# EAGLE design power (EAGLE 9.6.2)
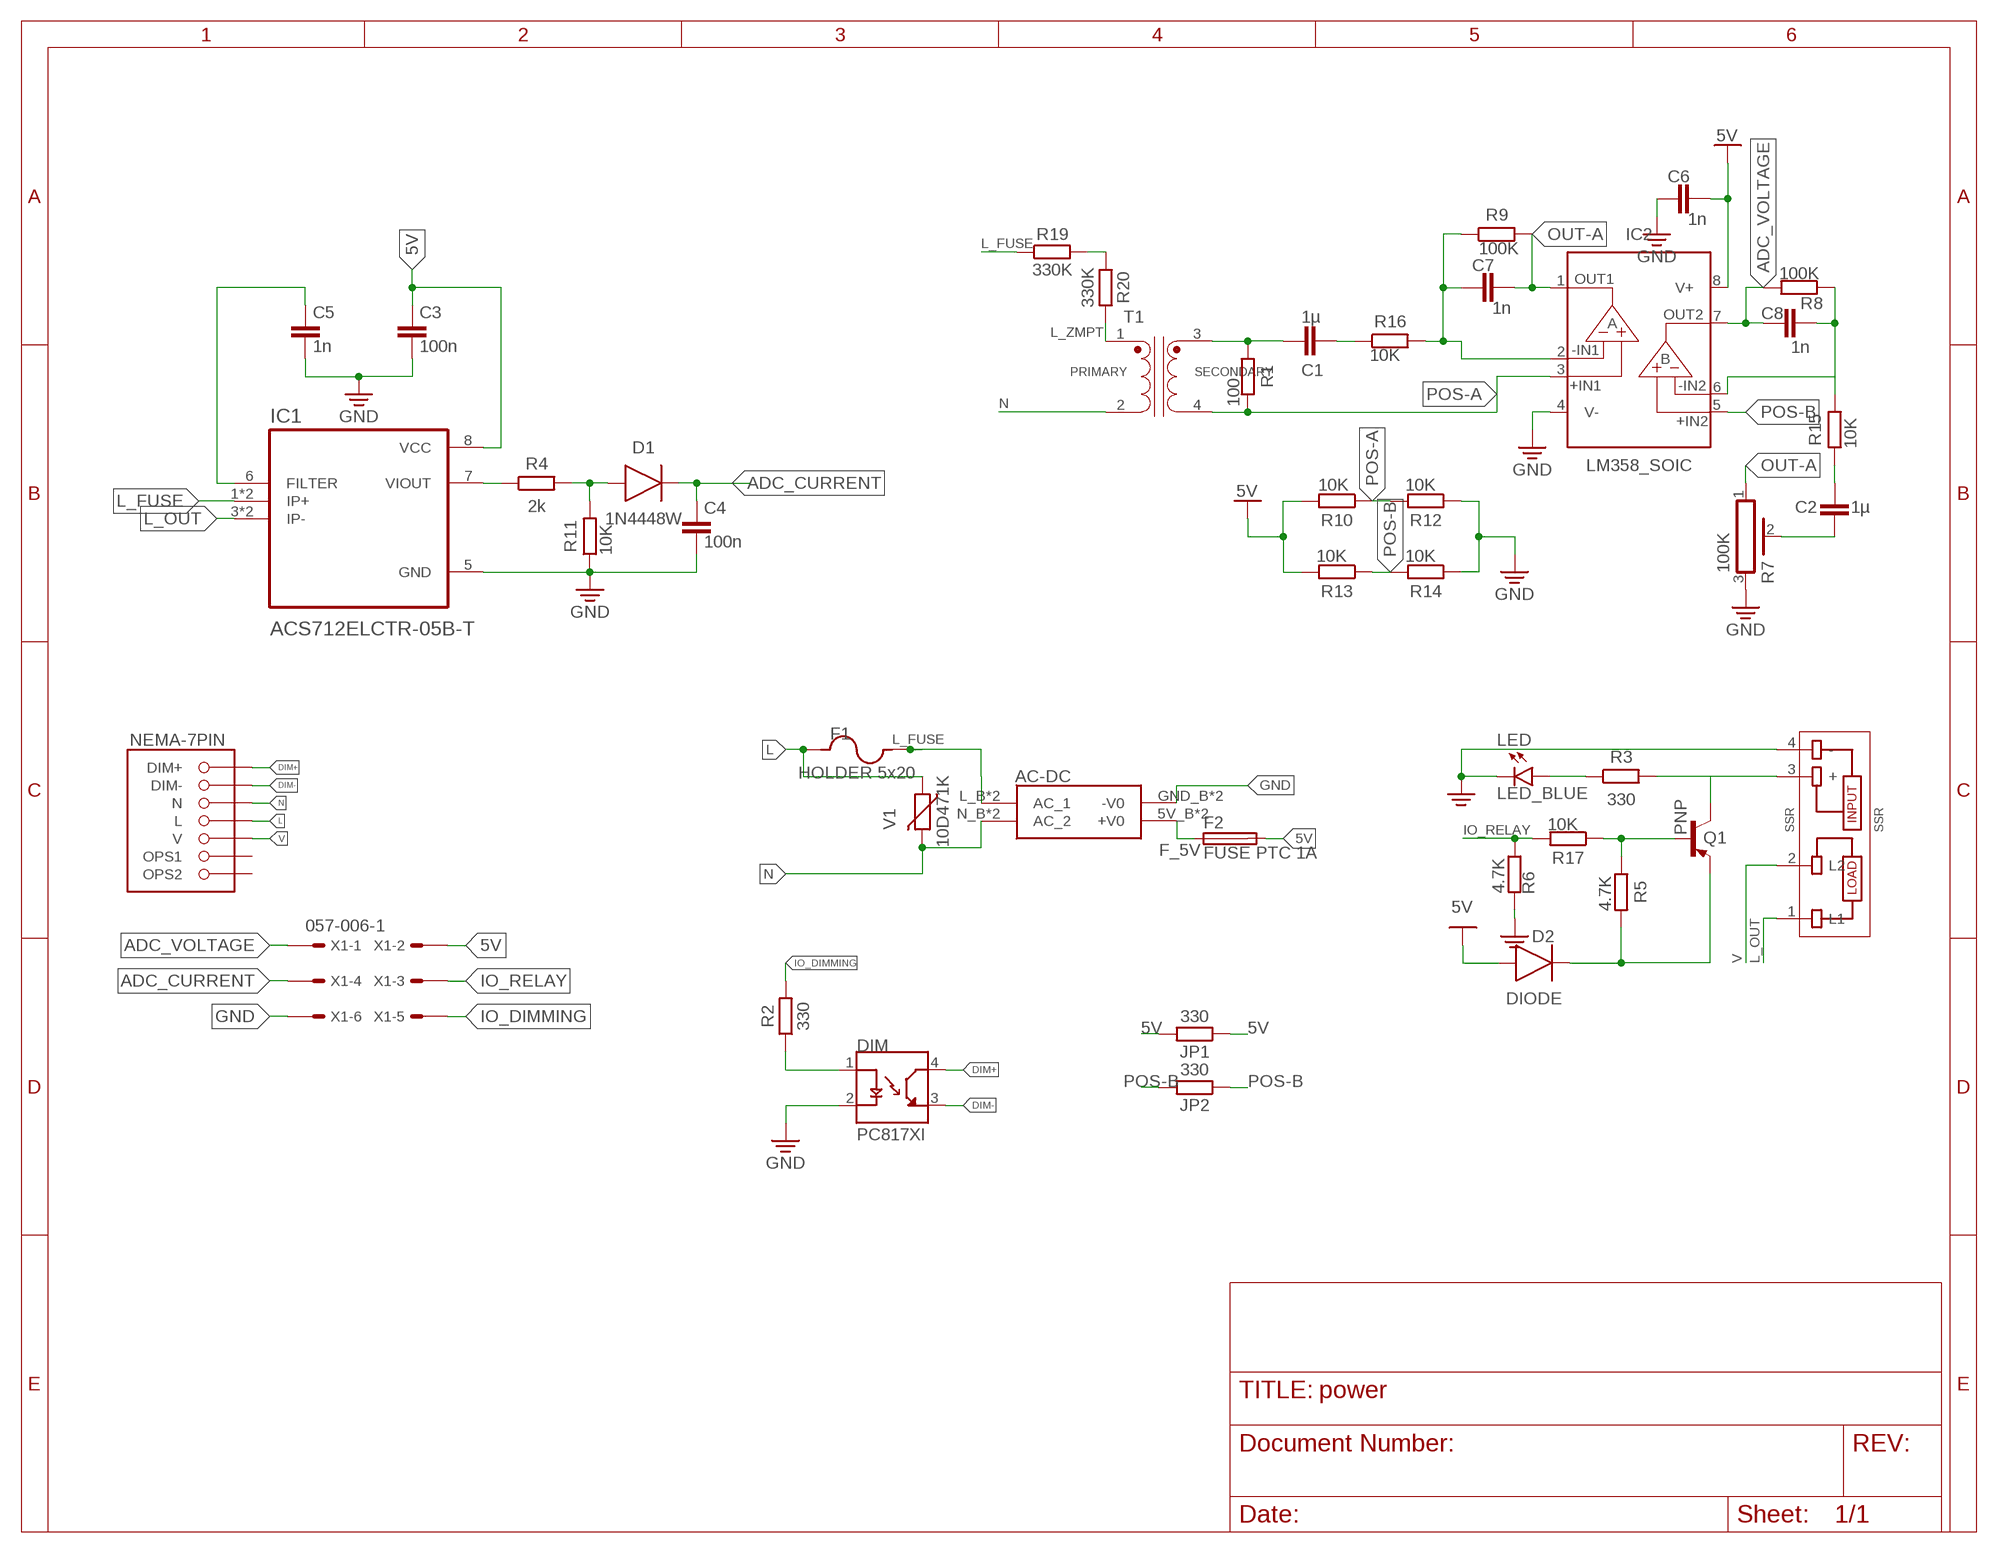
[diagram p0: schematic, sheet 1]

## Parts
AC-DC  HI-LINKVERTICAL  [AC-DC_3.5W(VER)]
C1  1µ  C_CHIP-0805(2012-METRIC)  [CAPC2012X110]
C2  1µ  C_CHIP-0805(2012-METRIC)  [CAPC2012X110]
C3  100n  C_CHIP-0805(2012-METRIC)  [CAPC2012X110]
C4  100n  C_CHIP-0805(2012-METRIC)  [CAPC2012X110]
C5  1n  C_CHIP-0805(2012-METRIC)  [CAPC2012X110]
C6  1n  C_CHIP-0805(2012-METRIC)  [CAPC2012X110]
C7  1n  C_CHIP-0805(2012-METRIC)  [CAPC2012X110]
C8  1n  C_CHIP-0805(2012-METRIC)  [CAPC2012X110]
D1  1N4448W  DIODE_1N4148W-7-F_SOD123G  [SOD3715X135]
D2  DIODE  DIODEDO-214AC(SMA)  [DIOM5226X290N]
DIM  PC817XI  [SOIC254P975X460-4N]
F1  HOLDER 5x20  4527  [4527]
F2  FUSE PTC 1A  FUSE_CHIP-1206(3216-METRIC)  [FUSC3215X82N]
IC1  ACS712ELCTR-05B-T  [SOIC127P600X175-8N@1]
IC2  LM358_SOIC  [SOIC127P600X175-8N]
JP1  330  R_CHIP-0805(2012-METRIC)  [RESC2012X65]
JP2  330  R_CHIP-0805(2012-METRIC)  [RESC2012X65]
LED  LED_BLUE  CHIP-FLAT-B_0805  [LEDC2012X110N_FLAT-B]
NEMA-7PIN  NEMA-7P  [NEMA-7P]
Q1  PNP  PNP_SOT23-BEC  [SOT95P237X112-3N]
R1  100  R_CHIP-0805(2012-METRIC)  [RESC2012X65]
R2  330  R_CHIP-0805(2012-METRIC)  [RESC2012X65]
R3  330  R_CHIP-0805(2012-METRIC)  [RESC2012X65]
R4  2k  R_CHIP-0805(2012-METRIC)  [RESC2012X65]
R5  4.7K  R_CHIP-0805(2012-METRIC)  [RESC2012X65]
R6  4.7K  R_CHIP-0805(2012-METRIC)  [RESC2012X65]
R7  100K  PV36W  [PV36W]
R8  100K  R_CHIP-0805(2012-METRIC)  [RESC2012X65]
R9  100K  R_CHIP-0805(2012-METRIC)  [RESC2012X65]
R10  10K  R_CHIP-0805(2012-METRIC)  [RESC2012X65]
R11  10K  R_CHIP-0805(2012-METRIC)  [RESC2012X65]
R12  10K  R_CHIP-0805(2012-METRIC)  [RESC2012X65]
R13  10K  R_CHIP-0805(2012-METRIC)  [RESC2012X65]
R14  10K  R_CHIP-0805(2012-METRIC)  [RESC2012X65]
R15  10K  R_CHIP-0805(2012-METRIC)  [RESC2012X65]
R16  10K  R_CHIP-0805(2012-METRIC)  [RESC2012X65]
R17  10K  R_CHIP-0805(2012-METRIC)  [RESC2012X65]
R19  330K  R_AXIAL-7.2MM-PITCH  [RESAD724W46L381D178B]
R20  330K  R_AXIAL-7.2MM-PITCH  [RESAD724W46L381D178B]
SSR  SSR  [SSR_G3MB-202P]
T1  ZMPT101B  [ZMPT101B]
V1  10D471K  VARISTOR  [MOV-10D561]
X1  057-006-1  [057-006-1]

## Nets
5V: C3.1 C6.2 D2.2(A) F2.2 IC1.8(VCC) IC2.8(V+) JP1.1 JP1.2 R10.2 R13.2 X1.2
ADC_CURRENT: C4.1 D1.1(C) X1.4
ADC_VOLTAGE: C8.1 IC2.7(OUT2) R8.2 X1.1
DIM+: DIM.4(CT) NEMA-7PIN.DIM+
DIM-: DIM.3(ET) NEMA-7PIN.DIM-
F_5V: AC-DC.5V_B(+V0) AC-DC.5V_T(+V0) F2.1
GND: AC-DC.GND_B(-V0) AC-DC.GND_T(-V0) C3.2 C4.2 C5.2 C6.1 DIM.2(C) IC1.5(GND) IC2.4(V-) LED.C R6.2 R7.3 R11.1 R12.1 R14.1 SSR.4(-) X1.6
IO_DIMMING: R2.2 X1.5
IO_RELAY: R6.1 R17.2 X1.3
L: F1.1 NEMA-7PIN.L V1.1
L_FUSE: AC-DC.L_B(AC_1) AC-DC.L_T(AC_1) F1.2 IC1.1(IP+) IC1.2(IP+) R19.1
L_OUT: IC1.3(IP-) IC1.4(IP-) SSR.1(L1)
L_ZMPT: R20.2 T1.1
N: AC-DC.N_B(AC_2) AC-DC.N_T(AC_2) NEMA-7PIN.N T1.2 V1.2
N$1: C1.1 R1.1 T1.3
N$3: C1.2 R16.1
N$4: IC1.7(VIOUT) R4.1
N$5: R19.2 R20.1
N$6: C7.1 IC2.2(-IN1) R9.1 R16.2
N$9: D1.2(A) R4.2 R11.2
N$11: C5.1 IC1.6(FILTER)
N$12: D2.1(C) Q1.2(E) R5.2
N$13: Q1.1(B) R5.1 R17.1
N$15: Q1.3(C) R3.2 SSR.3(+)
N$16: C8.2 IC2.6(-IN2) R8.1 R15.2
N$17: C2.2 R15.1
N$18: C2.1 R7.2
N$24: LED.A R3.1
N$27: DIM.1(A) R2.1
OUT-A: C7.2 IC2.1(OUT1) R7.1 R9.2
POS-A: IC2.3(+IN1) R1.2 R10.1 R12.2 T1.4
POS-B: IC2.5(+IN2) JP2.1 JP2.2 R13.1 R14.2
V: NEMA-7PIN.V SSR.2(L2)
Unconnected: NEMA-7PIN.OPS1 NEMA-7PIN.OPS2

## Library data of the parts
AC-DC = XLKM#4:HI-LINK: HI-LINK HLK-10M05 Manufacturer : HI-LINK <https://lcsc.com//brand-detail/11515.html> Mfr.Part # HLK-10M05 LCSC Part # C403745 <https://lcsc.com/product-detail/show_C403745.html> Package : Through Hole Datasheet :  EasyEDA Model <javascript:void(0);> Power Module AC-DC Through Hole RoHS Source: Datasheet <https://datasheet.lcsc.com/szlcsc/1909111105_HI-LINK-HLK-10M05_C403745.pdf>
C1-C8 = Capacitor:C: Capacitor - Generic; CATEGORY: Capacitor
D1 = Diode:DIODE_: Diode Rectifier - Popular parts; CATEGORY: Diode; DESCRIPTION: DIODE GEN PURP 100V 300MA SOD123; MANUFACTURER: Diodes Incorporated; SUB-CATEGORY: Rectifier; VALUE: 1N4148W
D2 = Diode:DIODE: Diode Rectifier - Generic; CATEGORY: Diode; SUB-CATEGORY: Rectifier
DIM = SnapEDA Library:PC817XI: Semiconductors and Actives, Optocouplers/Optoisolators, trans, Optoelectronics, smd; MF: Sharp; STANDARD: IPC-7351B
F1 = Fuse Holder:4527: FUSE HLDR CARTRIDGE 250V 5A PCB Manufacturer's datasheet <https://www.keyelco.com/userAssets/file/M65p44.pdf>; CREATED_BY: PCBLayout.com; DIGIKEY_PN: 36-4527-ND; MANUFACTURER: Keystone Electronics; MPN: 4527
F2 = Circuit-Protection:FUSE: Fuse - Generic; CATEGORY: Circuit-Protection; SUB-CATEGORY: Fuse
IC1 = XLKM#4:ACS712ELCTR-05B-T
IC2 = IC_Linear:LM358: Dual Operational Amplifier Reference Datasheet <https://www.ti.com/lit/ds/symlink/lm158-n.pdf>; CATEGORY: Amplifier; DESCRIPTION: Dual Operational Amplifier; MANUFACTURER: Generic; MPN: Generic; SERIES: LM358; SUB-CATEGORY: OpAmp; TYPE: Dual
JP1 JP2 R1-R6 R8-R17 R19 R20 = Resistor:R: Resistor Fixed - Generic; CATEGORY: Resistor; SUB-CATEGORY: Fixed
LED = LED:CHIP-FLAT-B; CATEGORY: LED; COLOR: BLUE; DESCRIPTION: CHIP LED FLAT; SUB-CATEGORY: CHIP; TYPE: FLAT_TOP
NEMA-7PIN = XLKM#4:NEMA-7P
Q1 = Transistor:PNP: PNP - Generic; CATEGORY: Transistor; SUB-CATEGORY: BJT; TYPE: PNP
R7 = Resistor:PV36: Rectangular Trimmer Potentiometers - PV36 Series Datasheet <https://www.bourns.com/docs/Product-Datasheets/pv36.pdf>; CATEGORY: Resistor; DESCRIPTION: Lead Sealed Type Multiturn PV36 Series; MANUFACTURER: BOURNS; MPN: PV36W; OPERATING_TEMPERATURE: -55 to +125 °C; PART_STATUS: Active; ROHS_COMPLIANCE: RoHS Compliant; SERIES: PV36; SUB-CATEGORY: Trimpot; TYPE: Lead Sealed
SSR = XLKM#4:SSR: Relay 12vdc Isolation Photot; MANUFACTURER: Omron; PARTREV: N/A; STANDARD: Manufacturer Recommendation
T1 = XLKM#4:ZMPT101B: Current-type Voltage Transformer; MANUFACTURER: Qingxian Zeming Langxi Electronic; MAXIMUM_PACKAGE_HEIGHT: 18.8mm; PARTREV: NA; STANDARD: Manufacturer Recommendations
V1 = XLKM#4:VARISTOR
X1 = con-panduit:057-006-: CONNECTOR 6-pin series 057 contact pc board low profile headers; OC_FARNELL: unknown; OC_NEWARK: unknown

## Board
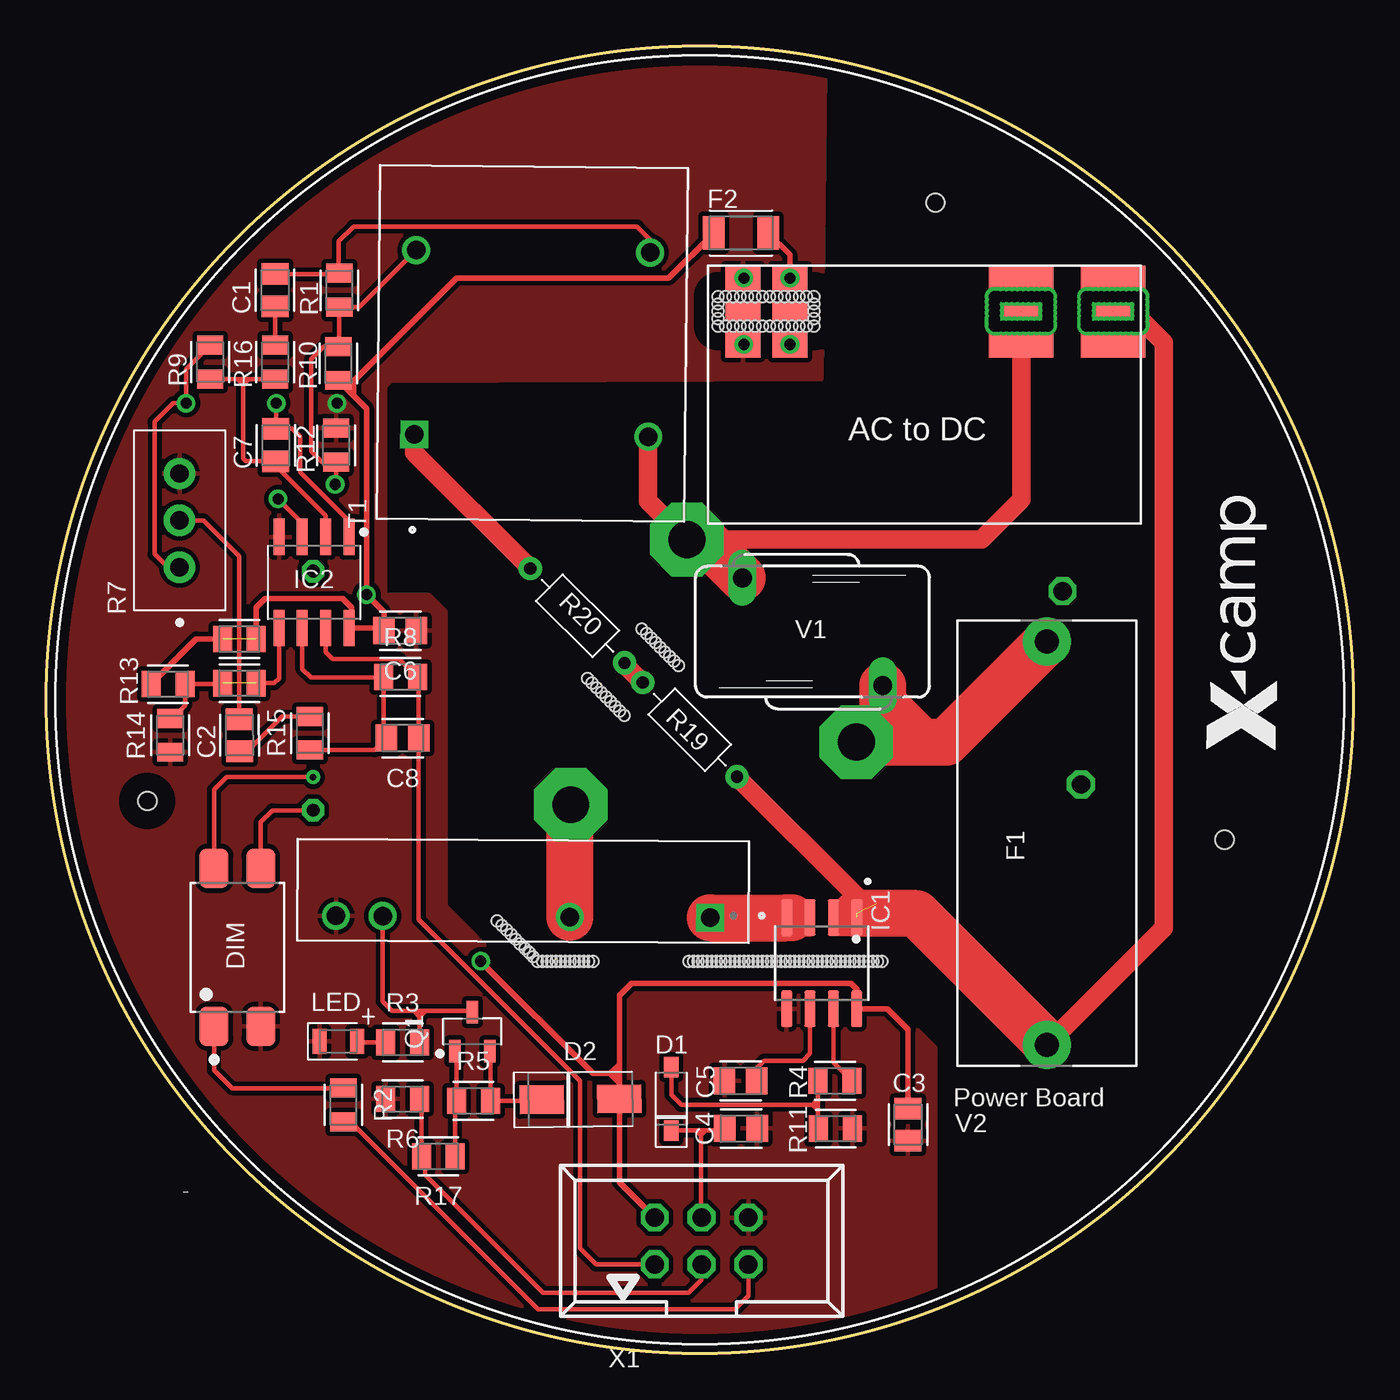
[diagram p1: board, top side]
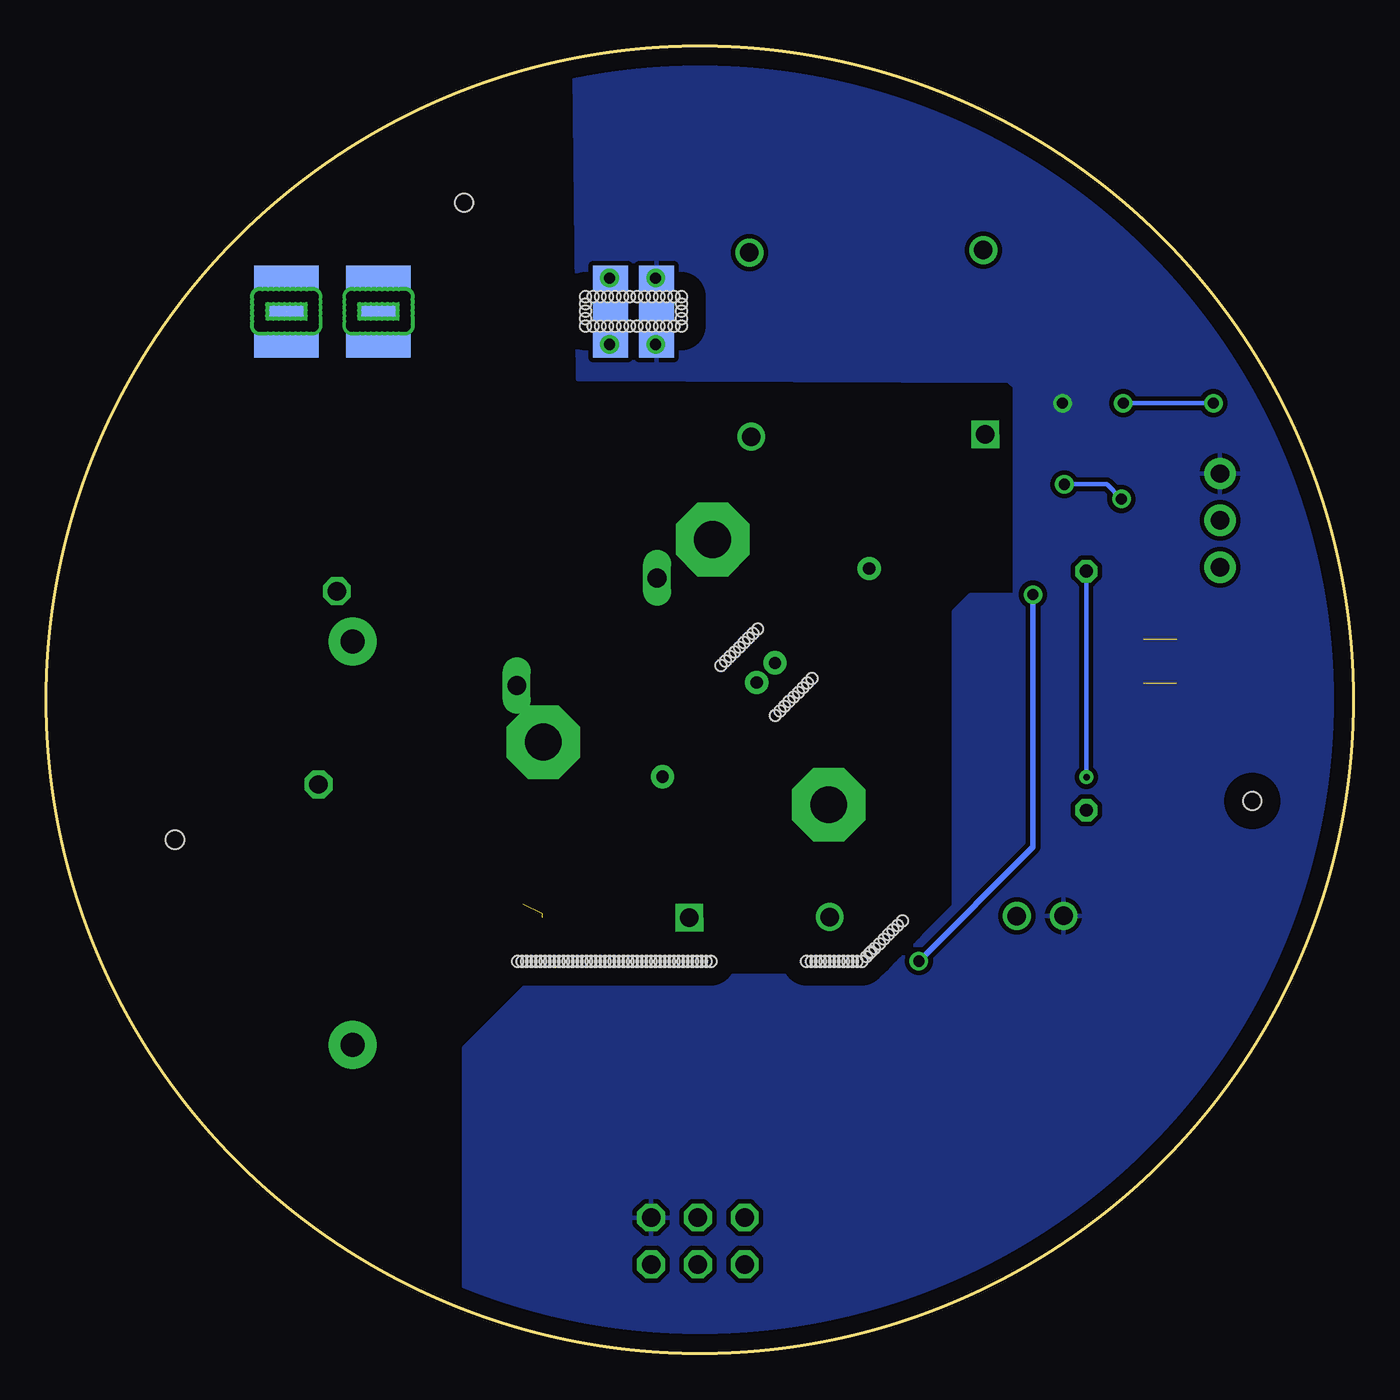
[diagram p2: board, bottom side, seen from below]

Size 71 x 71 mm. Coordinates in mm from the lower left corner, seen from the top.
Outline: circle at 35.5,35.5 radius 35.5
Copper layers (1*16): Top 0.035mm / dielectric 1.5mm / Bottom 0.035mm
Design rules "default": minimum track width 6mil, minimum drill 0.35mm, track to track 6mil, track to pad 6mil, pad to pad 6mil, via to via 6mil, smd to smd 6mil, copper to edge 40mil, drill to drill 6mil, minimum pad ring 10mil, minimum via ring 8mil, stop-mask expansion 4mil, vias tented up to drill 0mil, thermal gap 10mil
Holes 0.6 mm at 37.4,21.3 36.9,21.3 37.9,21.3 38.4,21.3 38.9,21.3 39.4,21.3 39.9,21.3 40.4,21.3 40.9,21.3 41.4,21.3 41.9,21.3 42.4,21.3 42.9,21.3 43.4,21.3 43.9,21.3 44.4,21.3 44.9,21.3 45.4,21.3 36.4,21.3 35.9,21.3 35.4,21.3 34.9,21.3 29.7,21.3 29.2,21.3 28.7,21.3 28.2,21.3 27.7,21.3 27.2,21.3 26.7,21.3 26.2,21.8 26,22 25.5,22.5 25,23 24.5,23.5 24.75,23.25 25.25,22.75 25.75,22.25 26.25,21.75 26.45,21.55 26.95,21.3 27.45,21.3 27.95,21.3 28.45,21.3 28.95,21.3 29.45,21.3 35.15,21.3 35.65,21.3 36.15,21.3 36.65,21.3 37.15,21.3 37.65,21.3 38.15,21.3 38.65,21.3 39.15,21.3 39.65,21.3 40.15,21.3 40.65,21.3 41.15,21.3 41.65,21.3 42.15,21.3 42.65,21.3 43.15,21.3 43.65,21.3 44.15,21.3 44.65,21.3 45.15,21.3 29.4,36.65 29.65,36.4 29.9,36.15 30.15,35.9 30.4,35.65 30.65,35.4 30.9,35.15 31.15,34.9 31.4,34.65 32.35,39.35 32.6,39.1 32.85,38.85 33.1,38.6 33.35,38.35 33.6,38.1 33.85,37.85 34.1,37.6 34.35,37.35 36.5,57.4 36.5,56.6 36.5,55.8 37.3,55.8 38.1,55.8 38.9,55.8 41.3,55.8 41.7,55.8 39.3,55.8 38.5,55.8 37.7,55.8 36.9,55.8 36.5,56.2 36.5,57 36.9,57.4 37.3,57.4 37.7,57.4 41.7,56.2 41.7,56.6 41.7,57 41.7,57.4 41.3,57.4 39.3,57.4 38.9,57.4 38.5,57.4 38.1,57.4 39.7,57.4 40.1,57.4 40.5,57.4 40.9,57.4 39.7,55.8 40.1,55.8 40.5,55.8 40.9,55.8
Holes 1 mm at 5.5,30 48.3,62.5 64,27.9

### Footprints (pad centres in the part's own frame; a part is rotated, then mirrored left to right if it is on the bottom)
AC-DC_3.5W(VER) = smd 1.9 x 5 bottom: 5V_B -7.2,3.8; GND_B -9.7,3.8 | smd 1.9 x 5: 5V_T -7.16,3.8; GND_T -9.7,3.8 | smd 3.5 x 5 bottom: L_B 10.4,3.8; N_B 5.4,3.8 | smd 3.5 x 5: L_T 10.4,3.8; N_T 5.4,3.8
CAPC2012X110 = smd 1.165 x 1.465: 1 -0.875,0; 2 0.875,0
SOD3715X135 = smd 1.127 x 0.784: 1 -1.722,0; 2 1.722,0
DIOM5226X290N = smd 2.392 x 1.565: 1 -2.108,0; 2 2.108,0
SOIC254P975X460-4N = smd 2.13 x 1.57: 1 -4.29,1.27; 2 -4.29,-1.27; 3 4.29,-1.27; 4 4.29,1.27
4527 = drill 1.3 pad 2.6: 1 -10.95,0; 2 10.95,0
FUSC3215X82N = smd 1.165 x 1.814: 1 -1.475,0; 2 1.475,0
SOIC127P600X175-8N@1 = smd 1.97 x 0.6: 1 -2.475,1.905; 2 -2.475,0.635; 3 -2.475,-0.635; 4 -2.475,-1.905; 5 2.475,-1.905; 6 2.475,-0.635; 7 2.475,0.635; 8 2.475,1.905
SOIC127P600X175-8N = smd 1.969 x 0.592: 1 -2.474,1.905; 2 -2.474,0.635; 3 -2.474,-0.635; 4 -2.474,-1.905; 5 2.474,-1.905; 6 2.474,-0.635; 7 2.474,0.635; 8 2.474,1.905
RESC2012X65 = smd 1.031 x 1.42: 1 -0.919,0; 2 0.919,0
LEDC2012X110N_FLAT-B = smd 0.762 x 1.362: A 1.025,0; C -1.025,0
NEMA-7P = drill 0.7 octagon: DIM+ -21,6.98; DIM- -21,-6 | drill 2 pad 4 octagon: L 8.5,-2.3; N -0.7,8.7; V -7,-5.7 | drill 1 octagon: OPS1 19.7,5.9; OPS2 20.7,-4.6
SOT95P237X112-3N = smd 1.224 x 0.625: 1 -1.064,0.95; 2 -1.064,-0.95; 3 1.064,0
PV36W = drill 1 pad 1.7: 1 0,0; 2 2.54,0; 3 5.08,0
RESAD724W46L381D178B = drill 0.66 pad 1.26: 1 -3.62,0; 2 3.62,0
SSR_G3MB-202P = drill 1 square: 1 -10.16,1.4 | drill 1: 2 -2.54,1.4; 3 7.62,1.4; 4 10.16,1.4
ZMPT101B = drill 1 square: 1 -5,6.35 | drill 1: 2 -5,-6.35; 3 5,-6.35; 4 5,6.35
MOV-10D561 = drill 1.016 long: 1 -2.921,-3.81; 2 2.921,3.81
057-006-1 = drill 1 octagon: 1 -2.54,-1.27; 2 -2.54,1.27; 3 0,-1.27; 4 0,1.27; 5 2.54,-1.27; 6 2.54,1.27

### Placement (x,y rotation side)
AC-DC  47.55,52.78 0 top
C1  12.44,57.74 270 top
C2  10.51,33.57 270.4 top
C3  46.81,12.43 270 top
C4  37.74,12.21 0 top
C5  37.72,14.8 180 top
C6  19.23,39.25 180 top
C7  12.48,49.33 90 top
C8  19.36,33.42 180 top
D1  33.95,13.83 90 top
D2  29.03,13.8 0.6 top
DIM  10.39,22.06 90 top
F1  54.35,27.71 270 top
F2  37.74,60.85 180 top
IC1  42.12,21.19 270 top
IC2  14.55,41.87 270 top
JP1  10.5,38.8 0 top
JP2  10.5,36.4 0 top
LED  15.87,16.95 0 top
NEMA-7PIN  35.5,35.5 0 top
Q1  23.15,17.48 90 top
R1  15.93,57.74 270 top
R2  16.15,13.5 270 top
R3  19.37,16.89 0 top
R4  42.84,14.8 180 top
R5  23.21,13.72 0 top
R6  19.36,13.82 180 top
R7  7.25,42.7 90 top
R8  19.25,36.74 0 top
R9  8.91,53.83 90 top
R10  15.88,53.76 270 top
R11  42.88,12.21 180 top
R12  15.75,49.32 270 top
R13  6.63,36.35 180 top
R14  6.74,33.57 90 top
R15  14.33,33.68 270 top
R16  12.45,53.83 270 top
R17  21.3,10.71 180 top
R19  34.96,33.88 135 top
R20  28.86,40.06 135 top
SSR  25.91,25.11 179.7 top
T1  26.4,54.85 89.4 top
V1  41.63,39.19 90 top
X1  35.6,6.11 0 top

### Tracks (layer width: path | path; a pad name or v marks a point on that pad's centre or on a via)
5V  (via drill 0.6 pad 1)  (1 unrouted)
  Top 0.305: C3.1 46.81,17.59 45.68,18.72 IC1.8 44.03,19.77 43.7,20.1 31.8,20.1 31.14,19.44 31.14,15.7 | F2.2 33.82,58.4 22.3,58.4 16.74,52.84 16.7,52.84 | 16.7,52.84 R10.2 16.66,52.06 | 16.66,52.06 17.4,51.32 v17.4,41.21 18.36,40.25 | 16.7,52.84 16.7,52.1 16.66,52.06 | 18.36,40.25 18.15,40.45 | 18.36,40.25 C6.2 18.21,39.4 IC2.8 16.61,39.25 16.61,40.49 16.1,41 11.9,41 11.42,40.52 JP1.2 | X1.2 31.14,9.3 D2.2 31.14,14.7 | 31.14,14.7 31.14,15.2 | 31.14,15.2 31.14,15.7 | v23.6,21.3 29.71,15.2 30.64,15.2 | 31.14,15.7 30.72,15.28 | 30.72,15.28 30.64,15.2 | 30.64,15.2 30.72,15.12 | 30.72,15.12 31.14,14.7 | 30.72,15.12 30.72,15.28 | 31.14,15.2 30.8,15.2 30.72,15.12 | JP1.1 8.16,38.8 R13.2
  Bottom 0.305: v17.4,41.21 17.4,27.51 v23.6,21.3
ADC_CURRENT
  Top 0.254: D1.1 35.3,12.11 | 35.3,12.11 35.8,12.11 | 35.8,12.11 36.76,12.11 C4.1 | X1.4 35.57,7.41 35.57,11.7 35.57,11.84 | 35.57,11.84 35.3,12.11 | 35.57,11.84 35.57,11.88 35.8,12.11
ADC_VOLTAGE
  Top 0.254: 20.27,33.45 C8.1 | 15.19,39.5 IC2.7 15.19,38.1 15.56,37.73 19.18,37.73 R8.2 20.24,36.66 C8.1 | C8.1 20.24,23.56 29,14.8 29,5.7 29.86,4.84 X1.1
DIM+  (via drill 0.35)
  Top 0.254: DIM.4 9.12,30.62 9.8,31.3 v14.5,31.3
  Bottom 0.254: v14.5,31.3 NEMA-7PIN.DIM+
DIM-
  Top 0.254: DIM.3 11.66,28.86 12.3,29.5 NEMA-7PIN.DIM-
F_5V  (via drill 0.6 pad 1)
  Top 0.305: F2.1 40.39,59.68 AC-DC.5V_T | v40.4,58.4 40.4,56.59 AC-DC.5V_T | AC-DC.5V_T 40.4,56.56 v40.4,54.8
  Bottom 0.305: AC-DC.5V_B 40.4,56.52 v40.4,54.8
GND  (via drill 0.6 pad 1)
  other vias: 37.9,54.8 37.9,58.4 15.8,51.6
  pour Bottom (isolate 0.254): 18.7,52.8 18.4,52.5 18.4,41.2 20.8,41.2 21.7,40.3 21.7,24.3 25.5,20.5 44.4,20.5 48.3,16.6 48.3,0.1 48.1,-0.1 20.2,-0.1 -0.1,20.2 -0.1,50.9 20.6,71.6 40.3,71.6 42.31,69.59 42.1,52.9
  pour Top (isolate 0.254): 18.7,52.8 18.4,52.5 18.4,41.2 20.8,41.2 21.7,40.3 21.7,24.3 25.5,20.5 44.4,20.5 48.3,16.6 48.3,0.1 48.1,-0.1 20.2,-0.1 -0.1,20.2 -0.1,50.9 20.6,71.6 40.3,71.6 42.31,69.59 42.1,52.9
IO_DIMMING
  Top 0.254: R2.2 16.55,12.58 26.73,2.4 37.4,2.4 38.14,3.14 X1.5
IO_RELAY
  Top 0.254: R6.1 20.38,13.72 R17.2 20.58,10.51 20.58,9.71 26.99,3.3 34.9,3.3 35.6,4 X1.3
L
  Top 1.016: NEMA-7PIN.L 45.44,34.64 V1.1
  Top 2.54: NEMA-7PIN.L 47.53,33.2 45.44,35.29 V1.1 | NEMA-7PIN.L 44,33.31 | NEMA-7PIN.L 48.89,33.2 F1.1
L_FUSE  (3 unrouted)
  Top 0.508: 45.1,24.4 42.9,24.4 42.76,24.26 IC1.2 42.76,22.94 42.77,22.93 45.15,22.93
  Top 1.016: AC-DC.L_T 59.02,56.58 60.7,54.9 60.7,23.11 F1.2 | R19.1 44.03,24.81 IC1.1
  Top 2.54: 44.03,23.89 47.27,23.89 54.35,16.81 F1.2
L_OUT
  Top 0.508: IC1.3 41.49,24.31 41.4,24.4 40.3,24.4 | IC1.3 41.49,22.9 40.1,22.9 | 40.5,23.67 IC1.3
  Top 2.54: SSR.1 IC1.4 40.5,23.67
L_ZMPT
  Top 1.016: R20.2 20,48.93 T1.1
N  (1 unrouted)
  Top 1.016: T1.2 32.7,46.3 NEMA-7PIN.N 50.8,44.2 52.97,46.37 52.97,56.55 AC-DC.N_T
  Top 2.54: 34.62,44.02 NEMA-7PIN.N 35.73,44.2 V1.2
N1
  Top 1.016: 57.97,56.55 57.95,56.58
N$1
  Top 0.254: T1.3 32.8,60.5 32.1,61.2 16.7,61.2 15.9,60.4 15.9,58.68 R1.1 15.89,58.62 C1.1
N$2  (via drill 0.6 pad 1)
  other vias: 51.7,55.8
N$3
  Top 0.254: C1.2 12.44,54.77 R16.1
N$4
  Top 0.254: IC1.7 42.76,15.81 R4.1
N$5
  Top 1.016: R19.2 31.42,37.42 R20.1
N$6
  Top 0.254: R9.1 10.4,52.91 | 10.4,52.91 11,52.91 | 11,52.91 R16.2 | 11,52.91 10.7,52.61 | 10.7,52.61 10.7,48.6 10.85,48.45 C7.1 12.48,48.22 15.19,45.51 IC2.2 | 10.7,52.61 10.4,52.91
N$7  (via drill 0.6 pad 1)
  other vias: 52,55.8
N$8  (via drill 0.6 pad 1)
  other vias: 52.3,55.8
N$9
  Top 0.254: R4.2 41.92,13.8 | 41.92,13.8 41.92,13.3 | 41.92,13.3 41.92,12.25 R11.2 | 41.92,13.8 41.62,13.5 | 41.62,13.5 41.83,13.3 41.92,13.3 | D1.2 33.95,14.05 34.5,13.5 41.62,13.5
N$10  (via drill 0.6 pad 1)
  other vias: 52.6,55.8
N$11
  Top 0.254: IC1.6 41.49,16.29 41.1,15.9 39,15.9 38.59,15.49 C5.1
N$12
  Top 0.254: Q1.2 24.13,16.39 R5.2 26.86,13.72 D2.1
N$13
  Top 0.254: R5.1 22.29,14 | 22.29,14 22.29,16.33 Q1.1 | R17.1 22.22,13.93 22.29,14
N$14  (via drill 0.6 pad 1)
  other vias: 52.9,55.8
N$15
  Top 0.254: R3.2 20.29,18.29 | 20.29,18.29 20.6,18.6 | 20.6,18.6 23.1,18.6 Q1.3 | SSR.3 18.28,19.12 18.8,18.6 19.9,18.6 19.98,18.6 | 19.98,18.6 20.6,18.6 | 20.29,18.29 19.98,18.6
N$16
  Top 0.254: C8.2 17.83,32.76 R15.2 | 18.43,33.48 C8.2 | C8.2 18.33,33.58 R8.1 18.29,36.7 14.4,36.7 13.92,37.18 IC2.6
N$17
  Top 0.254: C2.2 10.91,32.7 12.82,34.6 R15.1
N$18
  Top 0.254: R7.2 8.55,45.24 10.5,43.29 C2.1
N$19  (via drill 0.6 pad 1)
  other vias: 53.2,55.8
N$20  (via drill 0.6 pad 1)
  other vias: 53.5,55.8
N$21  (via drill 0.6 pad 1)
  other vias: 53.8,55.8
N$22  (via drill 0.6 pad 1)
  other vias: 54.1,55.8
N$23  (via drill 0.6 pad 1)
  other vias: 54.2,55.8
N$24
  Top 0.254: LED.A 16.96,16.89 R3.1
N$25  (via drill 0.6 pad 1)
  other vias: 51.7,57.4
N$26  (via drill 0.6 pad 1)
  other vias: 52,57.4
N$27
  Top 0.254: R2.1 16.13,14.4 10.1,14.4 9.12,15.38 DIM.1
N$28  (via drill 0.6 pad 1)
  other vias: 52.3,57.4
N$29  (via drill 0.6 pad 1)
  other vias: 52.6,57.4
N$30  (via drill 0.6 pad 1)
  other vias: 52.9,57.4
N$31  (via drill 0.6 pad 1)
  other vias: 53.2,57.4
N$32  (via drill 0.6 pad 1)
  other vias: 53.5,57.4
N$33  (via drill 0.6 pad 1)
  other vias: 53.8,57.4
N$34  (via drill 0.6 pad 1)
  other vias: 54.1,57.4
N$35  (via drill 0.6 pad 1)
  other vias: 54.4,57.4
N$36  (via drill 0.6 pad 1)
  other vias: 54.4,57.1
N$37  (via drill 0.6 pad 1)
  other vias: 54.4,56.8
N$38  (via drill 0.6 pad 1)
  other vias: 54.4,56.5
N$39  (via drill 0.6 pad 1)
  other vias: 54.4,56.2
N$40  (via drill 0.6 pad 1)
  other vias: 54.4,55.9
N$41  (via drill 0.6 pad 1)
  other vias: 54.4,55.8
N$42  (via drill 0.6 pad 1)
  other vias: 51.5,57.4
N$43  (via drill 0.6 pad 1)
  other vias: 51.5,57.1
N$44  (via drill 0.6 pad 1)
  other vias: 51.5,56.8
N$45  (via drill 0.6 pad 1)
  other vias: 51.5,56.5
N$46  (via drill 0.6 pad 1)
  other vias: 51.5,56.2
N$47  (via drill 0.6 pad 1)
  other vias: 51.5,56
N$48  (via drill 0.6 pad 1)
  other vias: 51.5,55.8
N$49  (via drill 0.6 pad 1)
  other vias: 56.7,55.8
N$50  (via drill 0.6 pad 1)
  other vias: 57,55.8
N$51  (via drill 0.6 pad 1)
  other vias: 57.3,55.8
N$52  (via drill 0.6 pad 1)
  other vias: 57.6,55.8
N$53  (via drill 0.6 pad 1)
  other vias: 57.9,55.8
N$54  (via drill 0.6 pad 1)
  other vias: 58.2,55.8
N$55  (via drill 0.6 pad 1)
  other vias: 58.5,55.8
N$56  (via drill 0.6 pad 1)
  other vias: 58.8,55.8
N$57  (via drill 0.6 pad 1)
  other vias: 59.1,55.8
N$58  (via drill 0.6 pad 1)
  other vias: 59.2,55.8
N$59  (via drill 0.6 pad 1)
  other vias: 56.7,57.4
N$60  (via drill 0.6 pad 1)
  other vias: 57,57.4
N$61  (via drill 0.6 pad 1)
  other vias: 57.3,57.4
N$62  (via drill 0.6 pad 1)
  other vias: 57.6,57.4
N$63  (via drill 0.6 pad 1)
  other vias: 57.9,57.4
N$64  (via drill 0.6 pad 1)
  other vias: 58.2,57.4
N$65  (via drill 0.6 pad 1)
  other vias: 58.5,57.4
N$66  (via drill 0.6 pad 1)
  other vias: 58.8,57.4
N$67  (via drill 0.6 pad 1)
  other vias: 59.1,57.4
N$68  (via drill 0.6 pad 1)
  other vias: 59.4,57.4
N$69  (via drill 0.6 pad 1)
  other vias: 59.4,57.1
N$70  (via drill 0.6 pad 1)
  other vias: 59.4,56.8
N$71  (via drill 0.6 pad 1)
  other vias: 59.4,56.5
N$72  (via drill 0.6 pad 1)
  other vias: 59.4,56.2
N$73  (via drill 0.6 pad 1)
  other vias: 59.4,55.9
N$74  (via drill 0.6 pad 1)
  other vias: 59.4,55.8
N$75  (via drill 0.6 pad 1)
  other vias: 56.5,57.4
N$76  (via drill 0.6 pad 1)
  other vias: 56.5,57.1
N$77  (via drill 0.6 pad 1)
  other vias: 56.5,56.8
N$78  (via drill 0.6 pad 1)
  other vias: 56.5,56.5
N$79  (via drill 0.6 pad 1)
  other vias: 56.5,56.2
N$80  (via drill 0.6 pad 1)
  other vias: 56.5,56
N$81  (via drill 0.6 pad 1)
  other vias: 56.5,55.8
OUT-A  (via drill 0.6 pad 1)
  Top 0.254: R9.2 7.6,53.44 v7.6,51.6 6.9,51.6 5.9,50.6 5.9,43.4 6.6,42.7 R7.1 | 12.5,50.22 C7.2 | v12.5,51.6 12.5,50.22 | 12.5,50.22 13.38,50.22 13.8,49.8 13.8,47.88 16.46,45.21 IC2.1
  Bottom 0.254: v12.5,51.6 v7.6,51.6
POS-A  (via drill 0.6 pad 1)
  Top 0.254: T1.4 17,56.82 R1.2 15.93,54.73 R10.1 15.08,54.68 14.4,54.01 14.4,49 15,48.4 R12.2 15.75,47.25 v15.7,47.2 | IC2.3 13.9,44.36 13.9,45.1 v12.6,46.4
  Bottom 0.254: v15.7,47.2 13.4,47.2 v12.6,46.4
POS-B  (1 unrouted)
  Top 0.254: R14.2 6.84,34.49 7.55,35.19 R13.1 9.53,36.35 JP2.1 | IC2.5 12.65,39.2 12.65,38.55 12.65,36.65 12.4,36.4 JP2.2
V
  Top 2.54: SSR.2 28.44,30.34 NEMA-7PIN.V

### Text on the board
tPlace: Power Board | V2